# EAGLE schematic Sequencer-Memory-V1.0-1 (EAGLE 7.6.0)

## Sheet 1 of 6: I/O
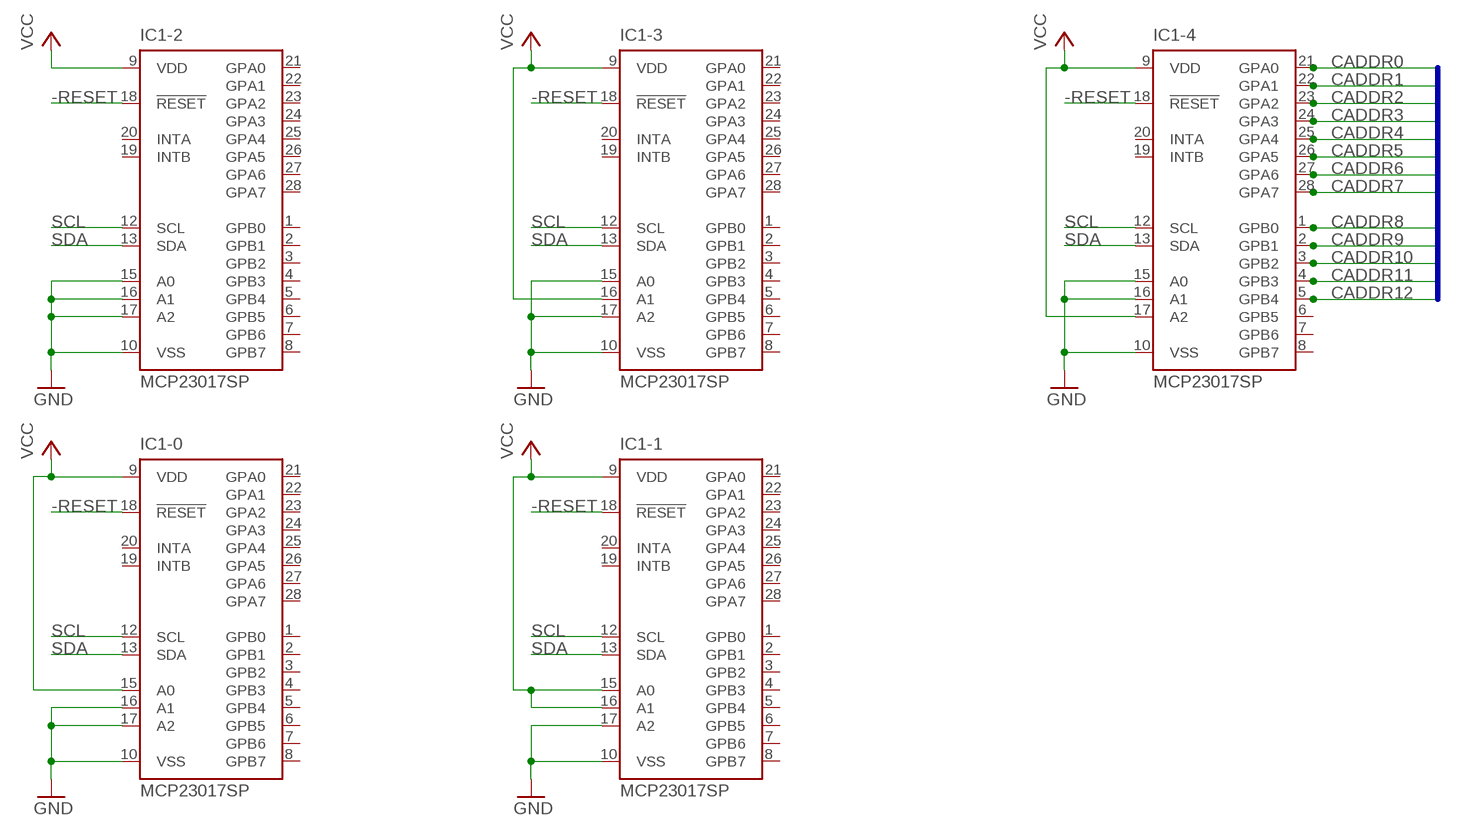
[diagram p0: schematic, sheet 1]

### Parts
IC1-0  MCP23017SP  [DIL28-3]
IC1-1  MCP23017SP  [DIL28-3]
IC1-2  MCP23017SP  [DIL28-3]
IC1-3  MCP23017SP  [DIL28-3]
IC1-4  MCP23017SP  [DIL28-3]

### Nets
-RESET: IC1-0.18(!RESET) IC1-1.18(!RESET) IC1-2.18(!RESET) IC1-3.18(!RESET) IC1-4.18(!RESET) ; also sheet 5,6
CADDR0: IC1-4.21(GPA0) ; also sheet 2,6
CADDR1: IC1-4.22(GPA1) ; also sheet 2,6
CADDR2: IC1-4.23(GPA2) ; also sheet 2,6
CADDR3: IC1-4.24(GPA3) ; also sheet 2,6
CADDR4: IC1-4.25(GPA4) ; also sheet 2,6
CADDR5: IC1-4.26(GPA5) ; also sheet 2,6
CADDR6: IC1-4.27(GPA6) ; also sheet 2,6
CADDR7: IC1-4.28(GPA7) ; also sheet 2,6
CADDR8: IC1-4.1(GPB0) ; also sheet 2,6
CADDR9: IC1-4.2(GPB1) ; also sheet 2,6
CADDR10: IC1-4.3(GPB2) ; also sheet 2,6
CADDR11: IC1-4.4(GPB3) ; also sheet 2,6
CADDR12: IC1-4.5(GPB4) ; also sheet 2,6
GND: IC1-0.10(VSS) IC1-0.16(A1) IC1-0.17(A2) IC1-1.10(VSS) IC1-1.17(A2) IC1-2.10(VSS) IC1-2.15(A0) IC1-2.16(A1) IC1-2.17(A2) IC1-3.10(VSS) IC1-3.15(A0) IC1-3.17(A2) IC1-4.10(VSS) IC1-4.15(A0) IC1-4.16(A1) ; also sheet 2,3,4,5,6
SCL: IC1-0.12(SCL) IC1-1.12(SCL) IC1-2.12(SCL) IC1-3.12(SCL) IC1-4.12(SCL) ; also sheet 5,6
SDA: IC1-0.13(SDA) IC1-1.13(SDA) IC1-2.13(SDA) IC1-3.13(SDA) IC1-4.13(SDA) ; also sheet 5,6
VCC: IC1-0.9(VDD) IC1-0.15(A0) IC1-1.9(VDD) IC1-1.15(A0) IC1-1.16(A1) IC1-2.9(VDD) IC1-3.9(VDD) IC1-3.16(A1) IC1-4.9(VDD) IC1-4.17(A2) ; also sheet 2,3,4,5,6
Unconnected: IC1-0.1(GPB0) IC1-0.2(GPB1) IC1-0.3(GPB2) IC1-0.4(GPB3) IC1-0.5(GPB4) IC1-0.6(GPB5) IC1-0.7(GPB6) IC1-0.8(GPB7) IC1-0.19(INTB) IC1-0.20(INTA) IC1-0.21(GPA0) IC1-0.22(GPA1) IC1-0.23(GPA2) IC1-0.24(GPA3) IC1-0.25(GPA4) IC1-0.26(GPA5) IC1-0.27(GPA6) IC1-0.28(GPA7) IC1-1.1(GPB0) IC1-1.2(GPB1) IC1-1.3(GPB2) IC1-1.4(GPB3) IC1-1.5(GPB4) IC1-1.6(GPB5) IC1-1.7(GPB6) IC1-1.8(GPB7) IC1-1.19(INTB) IC1-1.20(INTA) IC1-1.21(GPA0) IC1-1.22(GPA1) IC1-1.23(GPA2) IC1-1.24(GPA3) IC1-1.25(GPA4) IC1-1.26(GPA5) IC1-1.27(GPA6) IC1-1.28(GPA7) IC1-2.1(GPB0) IC1-2.2(GPB1) IC1-2.3(GPB2) IC1-2.4(GPB3) IC1-2.5(GPB4) IC1-2.6(GPB5) IC1-2.7(GPB6) IC1-2.8(GPB7) IC1-2.19(INTB) IC1-2.20(INTA) IC1-2.21(GPA0) IC1-2.22(GPA1) IC1-2.23(GPA2) IC1-2.24(GPA3) IC1-2.25(GPA4) IC1-2.26(GPA5) IC1-2.27(GPA6) IC1-2.28(GPA7) IC1-3.1(GPB0) IC1-3.2(GPB1) IC1-3.3(GPB2) IC1-3.4(GPB3) IC1-3.5(GPB4) IC1-3.6(GPB5) IC1-3.7(GPB6) IC1-3.8(GPB7) IC1-3.19(INTB) IC1-3.20(INTA) IC1-3.21(GPA0) IC1-3.22(GPA1) IC1-3.23(GPA2) IC1-3.24(GPA3) IC1-3.25(GPA4) IC1-3.26(GPA5) IC1-3.27(GPA6) IC1-3.28(GPA7) IC1-4.6(GPB5) IC1-4.7(GPB6) IC1-4.8(GPB7) IC1-4.19(INTB) IC1-4.20(INTA)

### Buses
CADDR[0..12]

## Sheet 2 of 6: Memory
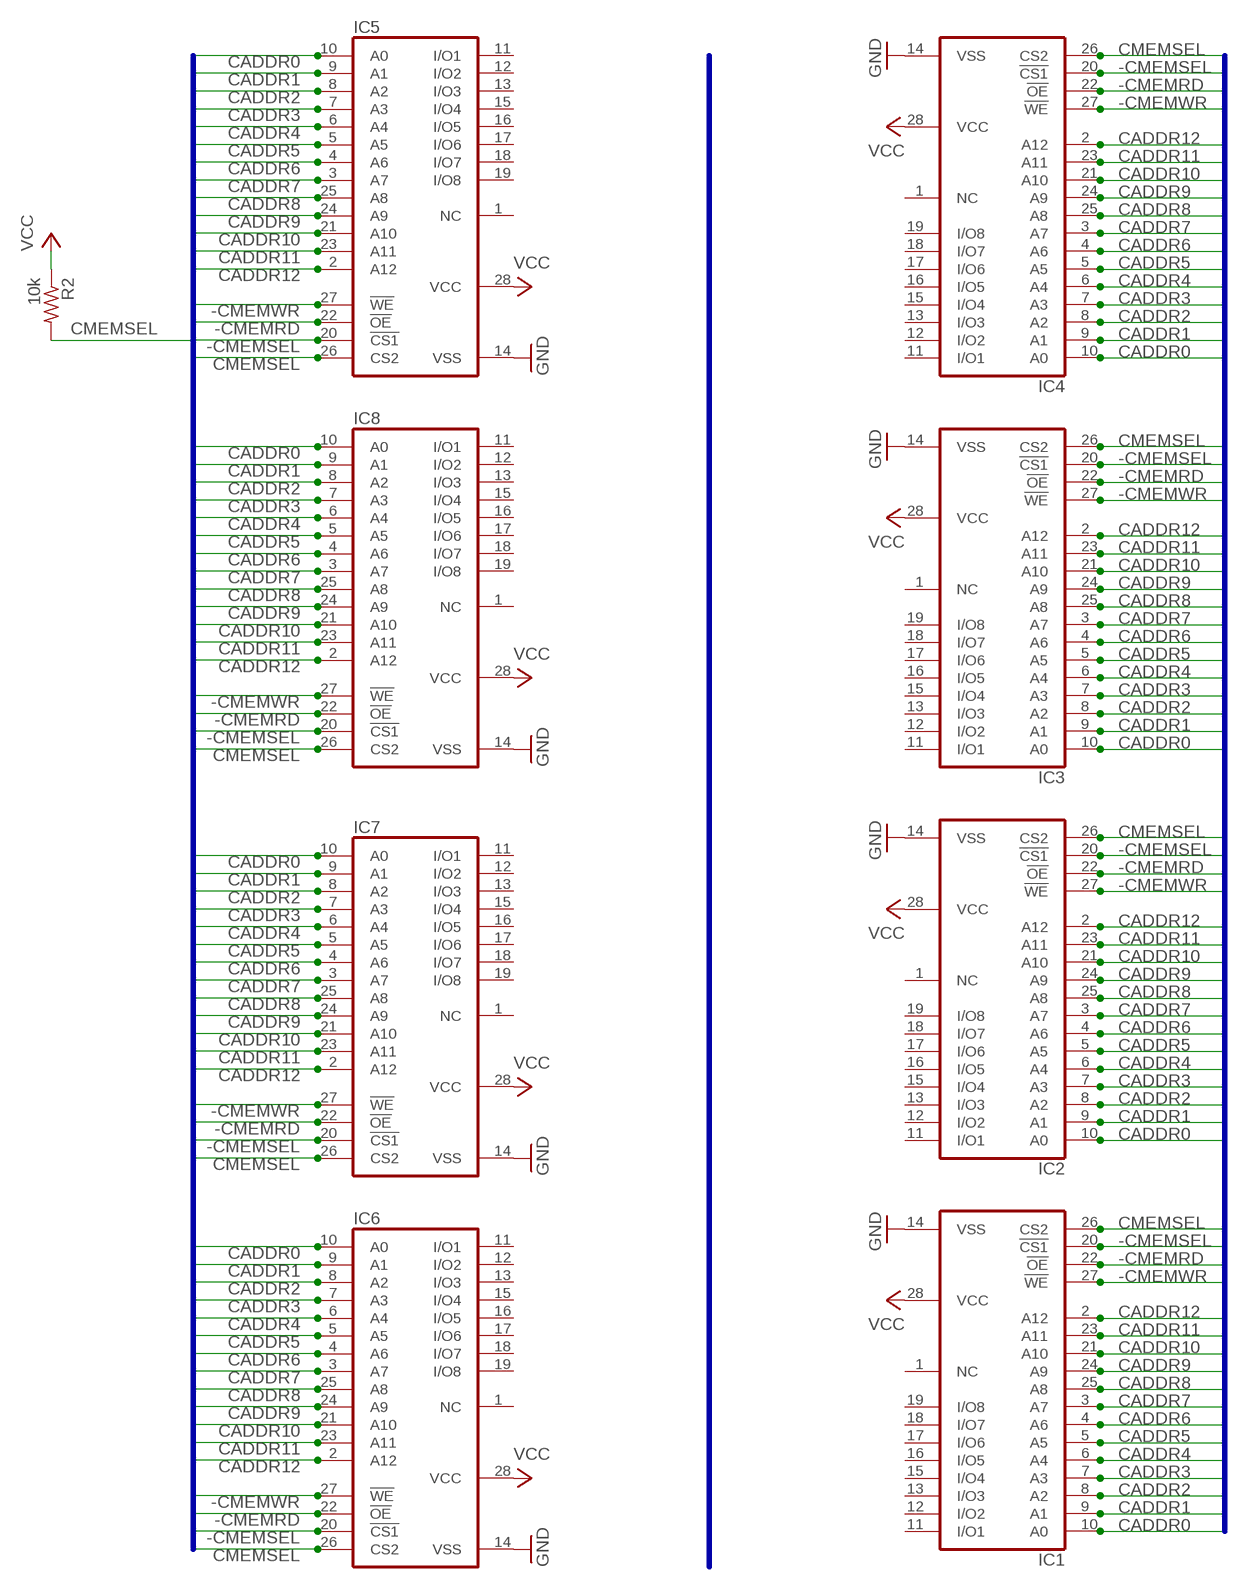
[diagram p1: schematic, sheet 2]

### Parts
IC1  6264A  [DIL28-6]
IC2  6264A  [DIL28-6]
IC3  6264A  [DIL28-6]
IC4  6264A  [DIL28-6]
IC5  6264A  [DIL28-6]
IC6  6264A  [DIL28-6]
IC7  6264A  [DIL28-6]
IC8  6264A  [DIL28-6]
R2  10k  R-US_0207/10  [0207/10]

### Nets
-CMEMRD: IC1.22(!OE) IC2.22(!OE) IC3.22(!OE) IC4.22(!OE) IC5.22(!OE) IC6.22(!OE) IC7.22(!OE) IC8.22(!OE)
-CMEMSEL: IC1.20(!CS1) IC2.20(!CS1) IC3.20(!CS1) IC4.20(!CS1) IC5.20(!CS1) IC6.20(!CS1) IC7.20(!CS1) IC8.20(!CS1)
-CMEMWR: IC1.27(!WE) IC2.27(!WE) IC3.27(!WE) IC4.27(!WE) IC5.27(!WE) IC6.27(!WE) IC7.27(!WE) IC8.27(!WE)
CADDR0: IC1.10(A0) IC2.10(A0) IC3.10(A0) IC4.10(A0) IC5.10(A0) IC6.10(A0) IC7.10(A0) IC8.10(A0) ; also sheet 1,6
CADDR1: IC1.9(A1) IC2.9(A1) IC3.9(A1) IC4.9(A1) IC5.9(A1) IC6.9(A1) IC7.9(A1) IC8.9(A1) ; also sheet 1,6
CADDR2: IC1.8(A2) IC2.8(A2) IC3.8(A2) IC4.8(A2) IC5.8(A2) IC6.8(A2) IC7.8(A2) IC8.8(A2) ; also sheet 1,6
CADDR3: IC1.7(A3) IC2.7(A3) IC3.7(A3) IC4.7(A3) IC5.7(A3) IC6.7(A3) IC7.7(A3) IC8.7(A3) ; also sheet 1,6
CADDR4: IC1.6(A4) IC2.6(A4) IC3.6(A4) IC4.6(A4) IC5.6(A4) IC6.6(A4) IC7.6(A4) IC8.6(A4) ; also sheet 1,6
CADDR5: IC1.5(A5) IC2.5(A5) IC3.5(A5) IC4.5(A5) IC5.5(A5) IC6.5(A5) IC7.5(A5) IC8.5(A5) ; also sheet 1,6
CADDR6: IC1.4(A6) IC2.4(A6) IC3.4(A6) IC4.4(A6) IC5.4(A6) IC6.4(A6) IC7.4(A6) IC8.4(A6) ; also sheet 1,6
CADDR7: IC1.3(A7) IC2.3(A7) IC3.3(A7) IC4.3(A7) IC5.3(A7) IC6.3(A7) IC7.3(A7) IC8.3(A7) ; also sheet 1,6
CADDR8: IC1.25(A8) IC2.25(A8) IC3.25(A8) IC4.25(A8) IC5.25(A8) IC6.25(A8) IC7.25(A8) IC8.25(A8) ; also sheet 1,6
CADDR9: IC1.24(A9) IC2.24(A9) IC3.24(A9) IC4.24(A9) IC5.24(A9) IC6.24(A9) IC7.24(A9) IC8.24(A9) ; also sheet 1,6
CADDR10: IC1.21(A10) IC2.21(A10) IC3.21(A10) IC4.21(A10) IC5.21(A10) IC6.21(A10) IC7.21(A10) IC8.21(A10) ; also sheet 1,6
CADDR11: IC1.23(A11) IC2.23(A11) IC3.23(A11) IC4.23(A11) IC5.23(A11) IC6.23(A11) IC7.23(A11) IC8.23(A11) ; also sheet 1,6
CADDR12: IC1.2(A12) IC2.2(A12) IC3.2(A12) IC4.2(A12) IC5.2(A12) IC6.2(A12) IC7.2(A12) IC8.2(A12) ; also sheet 1,6
CMEMSEL: IC1.26(CS2) IC2.26(CS2) IC3.26(CS2) IC4.26(CS2) IC5.26(CS2) IC6.26(CS2) IC7.26(CS2) IC8.26(CS2) R2.2
GND: IC1.14(VSS) IC2.14(VSS) IC3.14(VSS) IC4.14(VSS) IC5.14(VSS) IC6.14(VSS) IC7.14(VSS) IC8.14(VSS) ; also sheet 1,3,4,5,6
VCC: IC1.28(VCC) IC2.28(VCC) IC3.28(VCC) IC4.28(VCC) IC5.28(VCC) IC6.28(VCC) IC7.28(VCC) IC8.28(VCC) R2.1 ; also sheet 1,3,4,5,6
Unconnected: IC1.1(NC) IC1.11(I/O1) IC1.12(I/O2) IC1.13(I/O3) IC1.15(I/O4) IC1.16(I/O5) IC1.17(I/O6) IC1.18(I/O7) IC1.19(I/O8) IC2.1(NC) IC2.11(I/O1) IC2.12(I/O2) IC2.13(I/O3) IC2.15(I/O4) IC2.16(I/O5) IC2.17(I/O6) IC2.18(I/O7) IC2.19(I/O8) IC3.1(NC) IC3.11(I/O1) IC3.12(I/O2) IC3.13(I/O3) IC3.15(I/O4) IC3.16(I/O5) IC3.17(I/O6) IC3.18(I/O7) IC3.19(I/O8) IC4.1(NC) IC4.11(I/O1) IC4.12(I/O2) IC4.13(I/O3) IC4.15(I/O4) IC4.16(I/O5) IC4.17(I/O6) IC4.18(I/O7) IC4.19(I/O8) IC5.1(NC) IC5.11(I/O1) IC5.12(I/O2) IC5.13(I/O3) IC5.15(I/O4) IC5.16(I/O5) IC5.17(I/O6) IC5.18(I/O7) IC5.19(I/O8) IC6.1(NC) IC6.11(I/O1) IC6.12(I/O2) IC6.13(I/O3) IC6.15(I/O4) IC6.16(I/O5) IC6.17(I/O6) IC6.18(I/O7) IC6.19(I/O8) IC7.1(NC) IC7.11(I/O1) IC7.12(I/O2) IC7.13(I/O3) IC7.15(I/O4) IC7.16(I/O5) IC7.17(I/O6) IC7.18(I/O7) IC7.19(I/O8) IC8.1(NC) IC8.11(I/O1) IC8.12(I/O2) IC8.13(I/O3) IC8.15(I/O4) IC8.16(I/O5) IC8.17(I/O6) IC8.18(I/O7) IC8.19(I/O8)

### Buses
CADDR[0..12],-CMEMWR,-CMEMRD,CMEMSEL,-CMEMSEL
REG-FUNC,ADDR-REG-ID[0..1],ADDR-REG-LD,ADDR-REG-RD,REG-BRD-RD-ID[0..1],REG-RD-ID[0..1],REG-BRD-LD-ID[0..1],REG-LD-ID[0..1],REG-RD-LO,REG-LD-LO,REG-RD-HI,REG-LD-HI,MEM-WR,MEM-RD,I/O-WR,I/O-RD,I/O-ADDR,INT,INTA,I/D-REG-LD,I/D-REG-RD,I/D-REG-DN,I/D-REG-UP,SP/PC-SEL,SP/PC-DATA-RD-LO,SP/PC-DATA-RD-HI,SP/PC-ADDR-RD,SP/PC-LD-LO,SP/PC-LD-HI,SP/PC-DN,SP/PC-UP,ALU-FUNC,ALU[0..3],AC-LD-INV,AC-LD,AC-RD,SR-LD,BR-COND,H/L-SWAP,IN,OUT,UNUSED1,UNUSED2,RESET

## Sheet 3 of 6: Connector
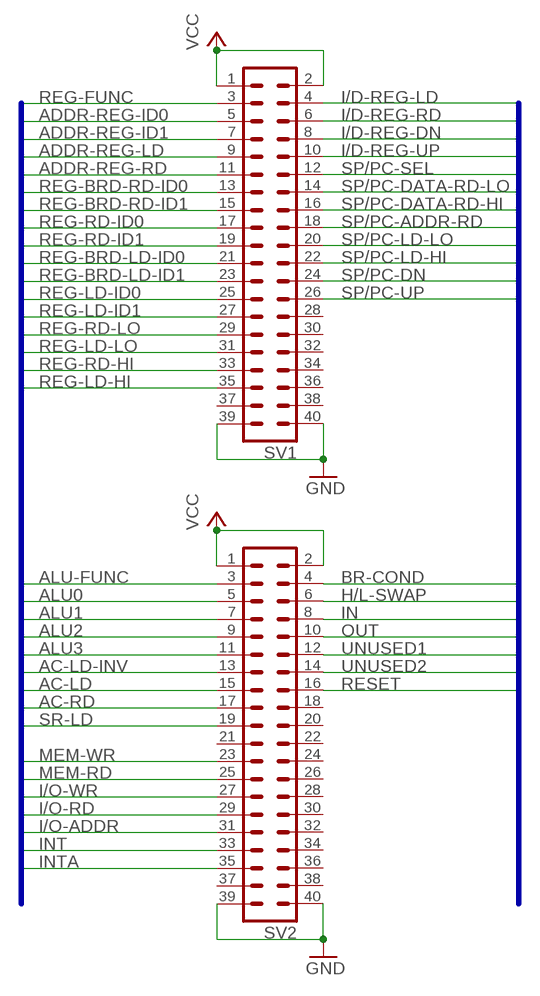
[diagram p2: schematic, sheet 3]

### Parts
SV1  MA20-2  [MA20-2]
SV2  MA20-2  [MA20-2]

### Nets
AC-LD: SV2.15 ; also sheet 4,6
AC-LD-INV: SV2.13 ; also sheet 4,6
AC-RD: SV2.17 ; also sheet 4,6
ADDR-REG-ID0: SV1.5 ; also sheet 4,6
ADDR-REG-ID1: SV1.7 ; also sheet 4,6
ADDR-REG-LD: SV1.9 ; also sheet 4,6
ADDR-REG-RD: SV1.11 ; also sheet 4,6
ALU0: SV2.5 ; also sheet 4,6
ALU1: SV2.7 ; also sheet 4,6
ALU2: SV2.9 ; also sheet 4,6
ALU3: SV2.11 ; also sheet 4,6
ALU-FUNC: SV2.3 ; also sheet 4,6
BR-COND: SV2.4 ; also sheet 4,6
GND: SV1.39 SV1.40 SV2.39 SV2.40 ; also sheet 1,2,4,5,6
H/L-SWAP: SV2.6 ; also sheet 4,6
I/D-REG-DN: SV1.8 ; also sheet 4,6
I/D-REG-LD: SV1.4 ; also sheet 4,6
I/D-REG-RD: SV1.6 ; also sheet 4,6
I/D-REG-UP: SV1.10 ; also sheet 4,6
I/O-ADDR: SV2.31 ; also sheet 4,6
I/O-RD: SV2.29 ; also sheet 4,6
I/O-WR: SV2.27 ; also sheet 4,6
IN: SV2.8 ; also sheet 4,6
INT: SV2.33 ; also sheet 4,6
INTA: SV2.35 ; also sheet 4,6
MEM-RD: SV2.25 ; also sheet 4,6
MEM-WR: SV2.23 ; also sheet 4,6
OUT: SV2.10 ; also sheet 4,6
REG-BRD-LD-ID0: SV1.21 ; also sheet 4,6
REG-BRD-LD-ID1: SV1.23 ; also sheet 4,6
REG-BRD-RD-ID0: SV1.13 ; also sheet 4,6
REG-BRD-RD-ID1: SV1.15 ; also sheet 4,6
REG-FUNC: SV1.3 ; also sheet 4,6
REG-LD-HI: SV1.35 ; also sheet 4,6
REG-LD-ID0: SV1.25 ; also sheet 4,6
REG-LD-ID1: SV1.27 ; also sheet 4,6
REG-LD-LO: SV1.31 ; also sheet 4,6
REG-RD-HI: SV1.33 ; also sheet 4,6
REG-RD-ID0: SV1.17 ; also sheet 4,6
REG-RD-ID1: SV1.19 ; also sheet 4,6
REG-RD-LO: SV1.29 ; also sheet 4,6
RESET: SV2.16 ; also sheet 4,6
SP/PC-ADDR-RD: SV1.18 ; also sheet 4,6
SP/PC-DATA-RD-HI: SV1.16 ; also sheet 4,6
SP/PC-DATA-RD-LO: SV1.14 ; also sheet 4,6
SP/PC-DN: SV1.24 ; also sheet 4,6
SP/PC-LD-HI: SV1.22 ; also sheet 4,6
SP/PC-LD-LO: SV1.20 ; also sheet 4,6
SP/PC-SEL: SV1.12 ; also sheet 4,6
SP/PC-UP: SV1.26 ; also sheet 4,6
SR-LD: SV2.19 ; also sheet 4,6
UNUSED1: SV2.12 ; also sheet 4,6
UNUSED2: SV2.14 ; also sheet 4,6
VCC: SV1.1 SV1.2 SV2.1 SV2.2 ; also sheet 1,2,4,5,6
Unconnected: SV1.28 SV1.30 SV1.32 SV1.34 SV1.36 SV1.37 SV1.38 SV2.18 SV2.20 SV2.21 SV2.22 SV2.24 SV2.26 SV2.28 SV2.30 SV2.32 SV2.34 SV2.36 SV2.37 SV2.38

### Buses
REG-FUNC,ADDR-REG-ID[0..1],ADDR-REG-LD,ADDR-REG-RD,REG-BRD-RD-ID[0..1],REG-RD-ID[0..1],REG-BRD-LD-ID[0..1],REG-LD-ID[0..1],REG-RD-LO,REG-LD-LO,REG-RD-HI,REG-LD-HI,MEM-WR,MEM-RD,I/O-WR,I/O-RD,I/O-ADDR,INT,INTA,I/D-REG-LD,I/D-REG-RD,I/D-REG-DN,I/D-REG-UP,SP/PC-SEL,SP/PC-DATA-RD-LO,SP/PC-DATA-RD-HI,SP/PC-ADDR-RD,SP/PC-LD-LO,SP/PC-LD-HI,SP/PC-DN,SP/PC-UP,ALU-FUNC,ALU[0..3],AC-LD-INV,AC-LD,AC-RD,SR-LD,BR-COND,H/L-SWAP,IN,OUT,UNUSED1,UNUSED2,RESET

## Sheet 4 of 6: CONNECTOR NEW
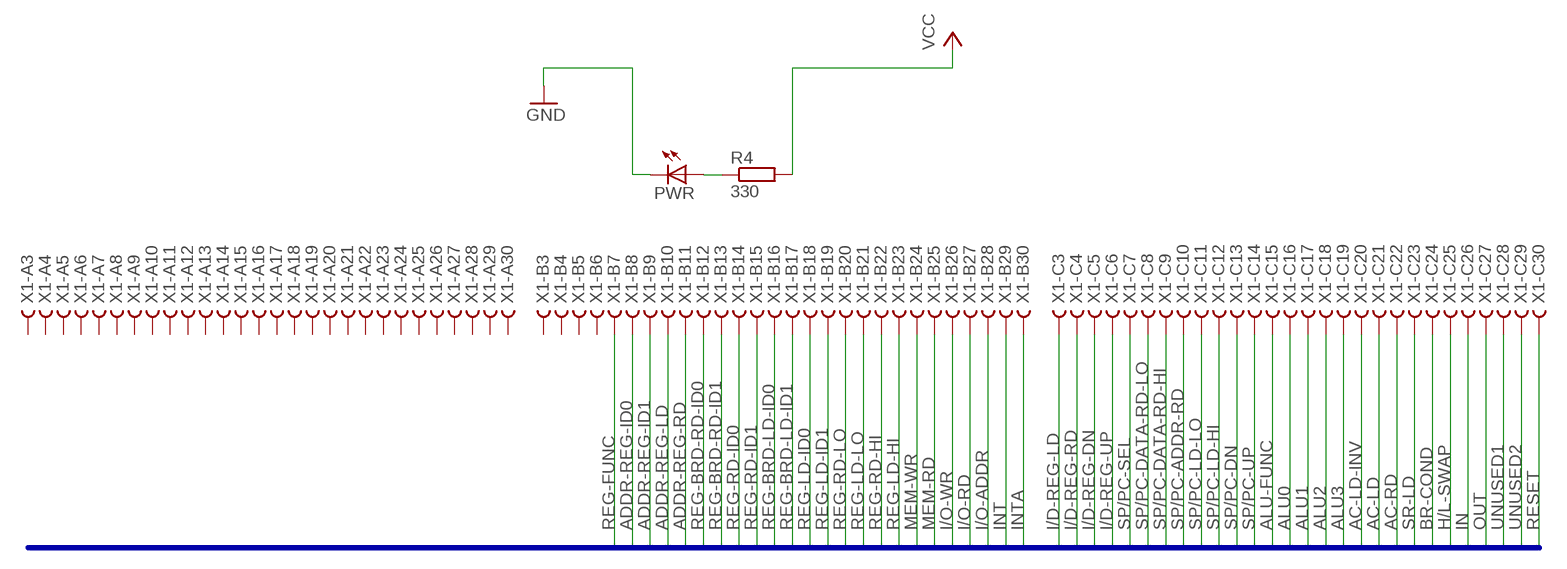
[diagram p3: schematic, sheet 4]

### Parts
PWR  LED5MM  [LED5MM]
R4  330  R0207/10  [0207/10]
X1  FABC96R  [FABC96R]

### Nets
AC-LD: X1.C21 ; also sheet 3,6
AC-LD-INV: X1.C20 ; also sheet 3,6
AC-RD: X1.C22 ; also sheet 3,6
ADDR-REG-ID0: X1.B8 ; also sheet 3,6
ADDR-REG-ID1: X1.B9 ; also sheet 3,6
ADDR-REG-LD: X1.B10 ; also sheet 3,6
ADDR-REG-RD: X1.B11 ; also sheet 3,6
ALU0: X1.C16 ; also sheet 3,6
ALU1: X1.C17 ; also sheet 3,6
ALU2: X1.C18 ; also sheet 3,6
ALU3: X1.C19 ; also sheet 3,6
ALU-FUNC: X1.C15 ; also sheet 3,6
BR-COND: X1.C24 ; also sheet 3,6
GND: PWR.K(C) ; also sheet 1,2,3,5,6
H/L-SWAP: X1.C25 ; also sheet 3,6
I/D-REG-DN: X1.C5 ; also sheet 3,6
I/D-REG-LD: X1.C3 ; also sheet 3,6
I/D-REG-RD: X1.C4 ; also sheet 3,6
I/D-REG-UP: X1.C6 ; also sheet 3,6
I/O-ADDR: X1.B28 ; also sheet 3,6
I/O-RD: X1.B27 ; also sheet 3,6
I/O-WR: X1.B26 ; also sheet 3,6
IN: X1.C26 ; also sheet 3,6
INT: X1.B29 ; also sheet 3,6
INTA: X1.B30 ; also sheet 3,6
MEM-RD: X1.B25 ; also sheet 3,6
MEM-WR: X1.B24 ; also sheet 3,6
N$10: PWR.A R4.1
OUT: X1.C27 ; also sheet 3,6
REG-BRD-LD-ID0: X1.B16 ; also sheet 3,6
REG-BRD-LD-ID1: X1.B17 ; also sheet 3,6
REG-BRD-RD-ID0: X1.B12 ; also sheet 3,6
REG-BRD-RD-ID1: X1.B13 ; also sheet 3,6
REG-FUNC: X1.B7 ; also sheet 3,6
REG-LD-HI: X1.B23 ; also sheet 3,6
REG-LD-ID0: X1.B18 ; also sheet 3,6
REG-LD-ID1: X1.B19 ; also sheet 3,6
REG-LD-LO: X1.B21 ; also sheet 3,6
REG-RD-HI: X1.B22 ; also sheet 3,6
REG-RD-ID0: X1.B14 ; also sheet 3,6
REG-RD-ID1: X1.B15 ; also sheet 3,6
REG-RD-LO: X1.B20 ; also sheet 3,6
RESET: X1.C30 ; also sheet 3,6
SP/PC-ADDR-RD: X1.C10 ; also sheet 3,6
SP/PC-DATA-RD-HI: X1.C9 ; also sheet 3,6
SP/PC-DATA-RD-LO: X1.C8 ; also sheet 3,6
SP/PC-DN: X1.C13 ; also sheet 3,6
SP/PC-LD-HI: X1.C12 ; also sheet 3,6
SP/PC-LD-LO: X1.C11 ; also sheet 3,6
SP/PC-SEL: X1.C7 ; also sheet 3,6
SP/PC-UP: X1.C14 ; also sheet 3,6
SR-LD: X1.C23 ; also sheet 3,6
UNUSED1: X1.C28 ; also sheet 3,6
UNUSED2: X1.C29 ; also sheet 3,6
VCC: R4.2 ; also sheet 1,2,3,5,6
Unconnected: X1.A1 X1.A2 X1.A3 X1.A4 X1.A5 X1.A6 X1.A7 X1.A8 X1.A9 X1.A10 X1.A11 X1.A12 X1.A13 X1.A14 X1.A15 X1.A16 X1.A17 X1.A18 X1.A19 X1.A20 X1.A21 X1.A22 X1.A23 X1.A24 X1.A25 X1.A26 X1.A27 X1.A28 X1.A29 X1.A30 X1.A31 X1.A32 X1.B1 X1.B2 X1.B3 X1.B4 X1.B5 X1.B6 X1.B31 X1.B32 X1.C1 X1.C2 X1.C31 X1.C32

### Buses
REG-FUNC,ADDR-REG-ID[0..1],ADDR-REG-LD,ADDR-REG-RD,REG-BRD-RD-ID[0..1],REG-RD-ID[0..1],REG-BRD-LD-ID[0..1],REG-LD-ID[0..1],REG-RD-LO,REG-LD-LO,REG-RD-HI,REG-LD-HI,MEM-WR,MEM-RD,I/O-WR,I/O-RD,I/O-ADDR,INT,INTA,I/D-REG-LD,I/D-REG-RD,I/D-REG-DN,I/D-REG-UP,SP/PC-SEL,SP/PC-DATA-RD-LO,SP/PC-DATA-RD-HI,SP/PC-ADDR-RD,SP/PC-LD-LO,SP/PC-LD-HI,SP/PC-DN,SP/PC-UP,ALU-FUNC,ALU[0..3],AC-LD-INV,AC-LD,AC-RD,SR-LD,BR-COND,H/L-SWAP,IN,OUT,UNUSED1,UNUSED2,RESET

## Sheet 5 of 6: CPU
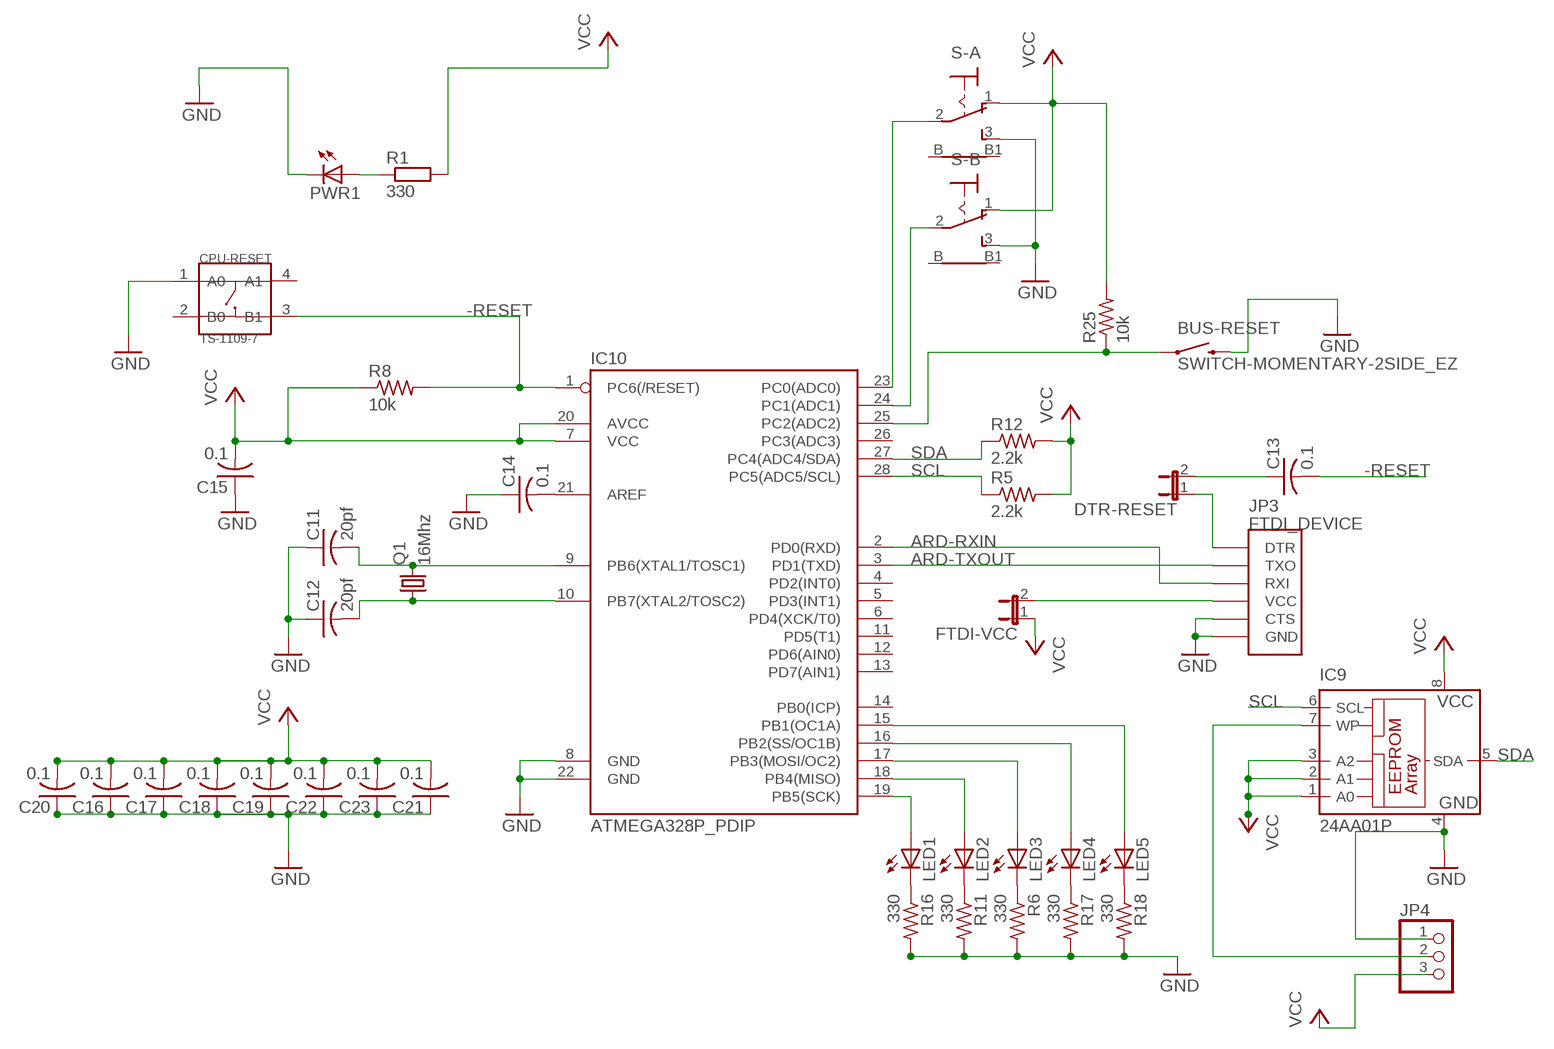
[diagram p4: schematic, sheet 5]

### Parts
BUS-RESET  SWITCH-MOMENTARY-2SIDE_EZ  [TACTILE-PTH-SIDEEZ]
C11  20pf  C-US025-024X044  [C025-024X044]
C12  20pf  C-US025-024X044  [C025-024X044]
C13  0.1  C-US025-024X044  [C025-024X044]
C14  0.1  C-US025-024X044  [C025-024X044]
C15  0.1  C-US025-024X044  [C025-024X044]
C16  0.1  C-US025-024X044  [C025-024X044]
C17  0.1  C-US025-024X044  [C025-024X044]
C18  0.1  C-US025-024X044  [C025-024X044]
C19  0.1  C-US025-024X044  [C025-024X044]
C20  0.1  C-US025-024X044  [C025-024X044]
C21  0.1  C-US025-024X044  [C025-024X044]
C22  0.1  C-US025-024X044  [C025-024X044]
C23  0.1  C-US025-024X044  [C025-024X044]
CPU-RESET  TS-1109-7  DIP-BUTTON-TOP-BLACK(4P-D6.2MM)  [SW4-6.2X6.2X5.0MM]
DTR-RESET  JP1E  [JP1]
FTDI-VCC  JP1E  [JP1]
IC9  24AA01P  [DIL8]
IC10  ATMEGA328P_PDIP  [DIL28-3]
JP3  FTDI_DEVICE  [FTDI_DEVICE_SIDE]
JP4  PINHD-1X3  [1X03]
LED1  LED5MM  [LED5MM]
LED2  LED5MM  [LED5MM]
LED3  LED5MM  [LED5MM]
LED4  LED5MM  [LED5MM]
LED5  LED5MM  [LED5MM]
PWR1  LED5MM  [LED5MM]
Q1  16Mhz  CRYSTALHC49S  [HC49/S]
R1  330  R0207/10  [0207/10]
R5  2.2k  R-US_0207/10  [0207/10]
R6  330  R-US_0207/10  [0207/10]
R8  10k  R-US_0207/10  [0207/10]
R11  330  R-US_0207/10  [0207/10]
R12  2.2k  R-US_0207/10  [0207/10]
R16  330  R-US_0207/10  [0207/10]
R17  330  R-US_0207/10  [0207/10]
R18  330  R-US_0207/10  [0207/10]
R25  10k  R-US_0207/10  [0207/10]
S-A  9070-1W  [9070-1W]
S-B  9070-1W  [9070-1W]

### Nets
-RESET: C13.2 CPU-RESET.3(B1) IC10.1(PC6(/RESET)) R8.2 ; also sheet 1,6
ARD-RXIN: IC10.2(PD0(RXD)) JP3.P$3(RXI)
ARD-TXOUT: IC10.3(PD1(TXD)) JP3.P$2(TXO)
GND: BUS-RESET.2 C11.1 C12.1 C14.1 C15.1 C16.1 C17.1 C18.1 C19.1 C20.1 C21.1 C22.1 C23.1 CPU-RESET.1(A0) IC9.4(GND) IC10.8(GND) IC10.22(GND) JP3.P$5(CTS) JP3.P$6(GND) JP4.1 PWR1.K(C) R6.2 R11.2 R16.2 R17.2 R18.2 S-A.3(S) S-B.3(S) ; also sheet 1,2,3,4,6
N$1: PWR1.A R1.1
N$6: C11.2 IC10.9(PB6(XTAL1/TOSC1)) Q1.2
N$7: C12.2 IC10.10(PB7(XTAL2/TOSC2)) Q1.1
N$8: C13.1 DTR-RESET.2
N$17: C14.2 IC10.21(AREF)
N$20: IC10.19(PB5(SCK)) LED1.A
N$21: IC10.18(PB4(MISO)) LED2.A
N$22: IC10.17(PB3(MOSI/OC2)) LED3.A
N$23: IC10.16(PB2(SS/OC1B)) LED4.A
N$24: IC10.15(PB1(OC1A)) LED5.A
N$25: LED2.K(C) R11.1
N$26: LED1.K(C) R16.1
N$27: LED3.K(C) R6.1
N$28: LED4.K(C) R17.1
N$29: LED5.K(C) R18.1
N$30: IC10.23(PC0(ADC0)) S-A.2(P)
N$31: IC10.24(PC1(ADC1)) S-B.2(P)
N$32: IC9.7(WP) JP4.2
N$33: DTR-RESET.1 JP3.P$1(DTR)
N$34: FTDI-VCC.2 JP3.P$4(VCC)
N$39: BUS-RESET.1 IC10.25(PC2(ADC2)) R25.1
SCL: IC9.6(SCL) IC10.28(PC5(ADC5/SCL)) R5.1 ; also sheet 1,6
SDA: IC9.5(SDA) IC10.27(PC4(ADC4/SDA)) R12.1 ; also sheet 1,6
VCC: C15.2 C16.2 C17.2 C18.2 C19.2 C20.2 C21.2 C22.2 C23.2 FTDI-VCC.1 IC9.1(A0) IC9.2(A1) IC9.3(A2) IC9.8(VCC) IC10.7(VCC) IC10.20(AVCC) JP4.3 R1.2 R5.2 R8.1 R12.2 R25.2 S-A.1(O) S-B.1(O) ; also sheet 1,2,3,4,6
Unconnected: CPU-RESET.2(B0) CPU-RESET.4(A1) IC10.4(PD2(INT0)) IC10.5(PD3(INT1)) IC10.6(PD4(XCK/T0)) IC10.11(PD5(T1)) IC10.12(PD6(AIN0)) IC10.13(PD7(AIN1)) IC10.14(PB0(ICP)) IC10.26(PC3(ADC3)) S-A.B S-A.B1 S-B.B S-B.B1

## Sheet 6 of 6: IO NEW
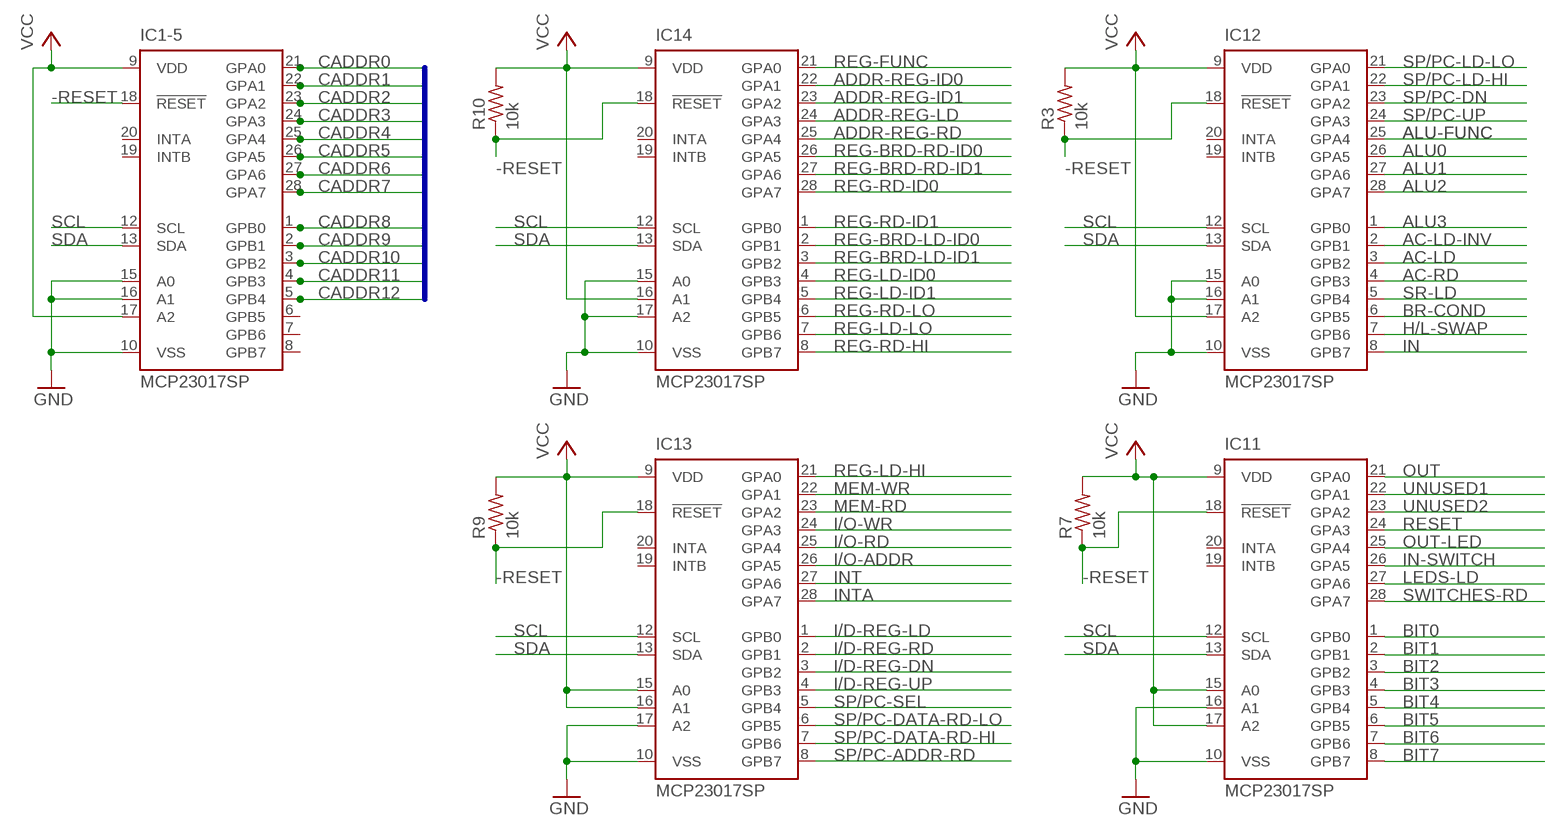
[diagram p5: schematic, sheet 6]

### Parts
IC1-5  MCP23017SP  [DIL28-3]
IC11  MCP23017SP  [DIL28-3]
IC12  MCP23017SP  [DIL28-3]
IC13  MCP23017SP  [DIL28-3]
IC14  MCP23017SP  [DIL28-3]
R3  10k  R-US_0207/10  [0207/10]
R7  10k  R-US_0207/10  [0207/10]
R9  10k  R-US_0207/10  [0207/10]
R10  10k  R-US_0207/10  [0207/10]

### Nets
-RESET: IC1-5.18(!RESET) IC11.18(!RESET) IC12.18(!RESET) IC13.18(!RESET) IC14.18(!RESET) R3.1 R7.1 R9.1 R10.1 ; also sheet 1,5
AC-LD: IC12.3(GPB2) ; also sheet 3,4
AC-LD-INV: IC12.2(GPB1) ; also sheet 3,4
AC-RD: IC12.4(GPB3) ; also sheet 3,4
ADDR-REG-ID0: IC14.22(GPA1) ; also sheet 3,4
ADDR-REG-ID1: IC14.23(GPA2) ; also sheet 3,4
ADDR-REG-LD: IC14.24(GPA3) ; also sheet 3,4
ADDR-REG-RD: IC14.25(GPA4) ; also sheet 3,4
ALU0: IC12.26(GPA5) ; also sheet 3,4
ALU1: IC12.27(GPA6) ; also sheet 3,4
ALU2: IC12.28(GPA7) ; also sheet 3,4
ALU3: IC12.1(GPB0) ; also sheet 3,4
ALU-FUNC: IC12.25(GPA4) ; also sheet 3,4
BIT0: IC11.1(GPB0)
BIT1: IC11.2(GPB1)
BIT2: IC11.3(GPB2)
BIT3: IC11.4(GPB3)
BIT4: IC11.5(GPB4)
BIT5: IC11.6(GPB5)
BIT6: IC11.7(GPB6)
BIT7: IC11.8(GPB7)
BR-COND: IC12.6(GPB5) ; also sheet 3,4
CADDR0: IC1-5.21(GPA0) ; also sheet 1,2
CADDR1: IC1-5.22(GPA1) ; also sheet 1,2
CADDR2: IC1-5.23(GPA2) ; also sheet 1,2
CADDR3: IC1-5.24(GPA3) ; also sheet 1,2
CADDR4: IC1-5.25(GPA4) ; also sheet 1,2
CADDR5: IC1-5.26(GPA5) ; also sheet 1,2
CADDR6: IC1-5.27(GPA6) ; also sheet 1,2
CADDR7: IC1-5.28(GPA7) ; also sheet 1,2
CADDR8: IC1-5.1(GPB0) ; also sheet 1,2
CADDR9: IC1-5.2(GPB1) ; also sheet 1,2
CADDR10: IC1-5.3(GPB2) ; also sheet 1,2
CADDR11: IC1-5.4(GPB3) ; also sheet 1,2
CADDR12: IC1-5.5(GPB4) ; also sheet 1,2
GND: IC1-5.10(VSS) IC1-5.15(A0) IC1-5.16(A1) IC11.10(VSS) IC11.16(A1) IC12.10(VSS) IC12.15(A0) IC12.16(A1) IC13.10(VSS) IC13.17(A2) IC14.10(VSS) IC14.15(A0) IC14.17(A2) ; also sheet 1,2,3,4,5
H/L-SWAP: IC12.7(GPB6) ; also sheet 3,4
I/D-REG-DN: IC13.3(GPB2) ; also sheet 3,4
I/D-REG-LD: IC13.1(GPB0) ; also sheet 3,4
I/D-REG-RD: IC13.2(GPB1) ; also sheet 3,4
I/D-REG-UP: IC13.4(GPB3) ; also sheet 3,4
I/O-ADDR: IC13.26(GPA5) ; also sheet 3,4
I/O-RD: IC13.25(GPA4) ; also sheet 3,4
I/O-WR: IC13.24(GPA3) ; also sheet 3,4
IN: IC12.8(GPB7) ; also sheet 3,4
IN-SWITCH: IC11.26(GPA5)
INT: IC13.27(GPA6) ; also sheet 3,4
INTA: IC13.28(GPA7) ; also sheet 3,4
LEDS-LD: IC11.27(GPA6)
MEM-RD: IC13.23(GPA2) ; also sheet 3,4
MEM-WR: IC13.22(GPA1) ; also sheet 3,4
OUT: IC11.21(GPA0) ; also sheet 3,4
OUT-LED: IC11.25(GPA4)
REG-BRD-LD-ID0: IC14.2(GPB1) ; also sheet 3,4
REG-BRD-LD-ID1: IC14.3(GPB2) ; also sheet 3,4
REG-BRD-RD-ID0: IC14.26(GPA5) ; also sheet 3,4
REG-BRD-RD-ID1: IC14.27(GPA6) ; also sheet 3,4
REG-FUNC: IC14.21(GPA0) ; also sheet 3,4
REG-LD-HI: IC13.21(GPA0) ; also sheet 3,4
REG-LD-ID0: IC14.4(GPB3) ; also sheet 3,4
REG-LD-ID1: IC14.5(GPB4) ; also sheet 3,4
REG-LD-LO: IC14.7(GPB6) ; also sheet 3,4
REG-RD-HI: IC14.8(GPB7) ; also sheet 3,4
REG-RD-ID0: IC14.28(GPA7) ; also sheet 3,4
REG-RD-ID1: IC14.1(GPB0) ; also sheet 3,4
REG-RD-LO: IC14.6(GPB5) ; also sheet 3,4
RESET: IC11.24(GPA3) ; also sheet 3,4
SCL: IC1-5.12(SCL) IC11.12(SCL) IC12.12(SCL) IC13.12(SCL) IC14.12(SCL) ; also sheet 1,5
SDA: IC1-5.13(SDA) IC11.13(SDA) IC12.13(SDA) IC13.13(SDA) IC14.13(SDA) ; also sheet 1,5
SP/PC-ADDR-RD: IC13.8(GPB7) ; also sheet 3,4
SP/PC-DATA-RD-HI: IC13.7(GPB6) ; also sheet 3,4
SP/PC-DATA-RD-LO: IC13.6(GPB5) ; also sheet 3,4
SP/PC-DN: IC12.23(GPA2) ; also sheet 3,4
SP/PC-LD-HI: IC12.22(GPA1) ; also sheet 3,4
SP/PC-LD-LO: IC12.21(GPA0) ; also sheet 3,4
SP/PC-SEL: IC13.5(GPB4) ; also sheet 3,4
SP/PC-UP: IC12.24(GPA3) ; also sheet 3,4
SR-LD: IC12.5(GPB4) ; also sheet 3,4
SWITCHES-RD: IC11.28(GPA7)
UNUSED1: IC11.22(GPA1) ; also sheet 3,4
UNUSED2: IC11.23(GPA2) ; also sheet 3,4
VCC: IC1-5.9(VDD) IC1-5.17(A2) IC11.9(VDD) IC11.15(A0) IC11.17(A2) IC12.9(VDD) IC12.17(A2) IC13.9(VDD) IC13.15(A0) IC13.16(A1) IC14.9(VDD) IC14.16(A1) R3.2 R7.2 R9.2 R10.2 ; also sheet 1,2,3,4,5
Unconnected: IC1-5.6(GPB5) IC1-5.7(GPB6) IC1-5.8(GPB7) IC1-5.19(INTB) IC1-5.20(INTA) IC11.19(INTB) IC11.20(INTA) IC12.19(INTB) IC12.20(INTA) IC13.19(INTB) IC13.20(INTA) IC14.19(INTB) IC14.20(INTA)

### Buses
CADDR[0..12]

## Library data of the parts
BUS-RESET = SparkFun-Electromechanical:SWITCH-MOMENTARY-2: Various NO switches- pushbuttons, reed, etc
C11-C23 = adafruit:C-US: CAPACITOR, American symbol
CPU-RESET = Seeed-OPL-Switch:DIP-BUTTON-TOP-BLACK(4P-D6.2MM): 311020032; MPN: TS-1109-7
DTR-RESET FTDI-VCC = jumper:JP1E: JUMPER
IC1-IC8 = memory-hitachi:6264A: MEMORY; OC_FARNELL: 283605; OC_NEWARK: unknown
IC1-0 IC1-1-IC1-5 IC11-IC14 = microchip:MCP23017: http://ww1.microchip.com/downloads/en/DeviceDoc/21952a.pdf Source: http://ww1.microchip.com/downloads/en/DeviceDoc/21952a.pdf; MF: MICROCHIP; MPN: MCP23017-E/SP; OC_FARNELL: 1332088; OC_NEWARK: 31K2959
IC9 = microchip:24*: Serial EEPROM I2C; MPN: 24AA01-I/P; OC_FARNELL: 1331266; OC_NEWARK: 35M0692
IC10 = SparkFun-DigitalIC:ATMEGA328P_PDIP: uC used in the Arduino 32kb flash, 1k EEPROM, 2k SRAM This is the through-hole version of this chip.
JP3 = SparkFun-Connectors:FTDI_DEVICE: Connector which mates to FTDI basic or FTDI cable.
JP4 = pinhead:PINHD-1X3: PIN HEADER
LED1-LED5 PWR PWR1 = led:LED: LED OSRAM: - CHIPLED LG R971, LG N971, LY N971, LG Q971, LY Q971, LO R971, LY R971 LH N974, LH R974 LS Q976, LO Q976, LY Q976 LO Q996 - Hyper CHIPLED LW Q18S LB Q993, LB Q99A, LB R99A - SideLED LS A670, LO A670, LY A670, LG A670, LP A670 LB A673, LV A673, LT A673, LW A673 LH A674 LY A675 LS A676, LA A676, LO A676, LY A676, LW A676 LS A679, LY A679, LG A679 - Hyper Micro SIDELED® LS Y876, LA Y876, LO Y876, LY Y876 LT Y87S - SmartLED LW L88C, LW L88S LB L89C, LB L89S, LG L890 LS L89K, LO L89K, LY L89K LS L896, LA L896, LO L896, LY L896 - TOPLED LS T670, LO T670, LY T670, LG T670, LP T670 LSG T670, LSP T670, LSY T670, LOP T670, LYG T670 LG T671, LOG T671, LSG T671 LB T673, LV T673, LT T673, LW T673 LH T674 LS T676, LA T676, LO T676, LY T676, LB T676, LH T676, LSB T676, LW T676 LB T67C, LV T67C, LT T67C, LS T67K, LO T67K, LY T67K, LW E67C LS E67B, LA E67B, LO E67B, LY E67B, LB E67C, LV E67C, LT E67C LW T67C LS T679, LY T679, LG T679 LS T770, LO T770, LY T770, LG T770, LP T770 LB T773, LV T773, LT T773, LW T773 LH T774 LS E675, LA E675, LY E675, LS T675 LS T776, LA T776, LO T776, LY T776, LB T776 LHGB T686 LT T68C, LB T68C - Hyper Mini TOPLED® LB M676 - Mini TOPLED Santana® LG M470 LS M47K, LO M47K, LY M47K Source: http://www.osram.convergy.de LUXEON: - LUMILED® LXK2-PW12-R00, LXK2-PW12-S00, LXK2-PW14-U00, LXK2-PW14-V00 LXK2-PM12-R00, LXK2-PM12-S00, LXK2-PM14-U00 LXK2-PE12-Q00, LXK2-PE12-R00, LXK2-PE12-S00, LXK2-PE14-T00, LXK2-PE14-U00 LXK2-PB12-K00, LXK2-PB12-L00, LXK2-PB12-M00, LXK2-PB14-N00, LXK2-PB14-P00, LXK2-PB14-Q00 LXK2-PR12-L00, LXK2-PR12-M00, LXK2-PR14-Q00, LXK2-PR14-R00 LXK2-PD12-Q00, LXK2-PD12-R00, LXK2-PD12-S00 LXK2-PH12-R00, LXK2-PH12-S00 LXK2-PL12-P00, LXK2-PL12-Q00, LXK2-PL12-R00 Source: www.luxeon.com KINGBRIGHT: KA-3528ASYC Source: www.kingbright.com
Q1 = crystal:CRYSTAL: CRYSTAL; OC_FARNELL: 1667008; OC_NEWARK: unknown
R1 R4 = eagle-ltspice:R: RESISTOR, European symbol; SPICEMODEL: NONE; SPICEPREFIX: R
R2 R5 R6 R8 R11 R12 R16-R18 R25 = resistor:R-US_: RESISTOR, American symbol
R3 R7 R9 R10 = adafruit:R-US_: RESISTOR, American symbol
S-A S-B = switch:9070-1W: TOGGLE SWITCH Marquardt
SV1 SV2 = con-lstb:MA20-2: PIN HEADER; OC_FARNELL: unknown; OC_NEWARK: unknown
X1 = con-vg:FABC96R: CONNECTOR female, 96 pins, type R, rows ABC, grid 2.54 mm